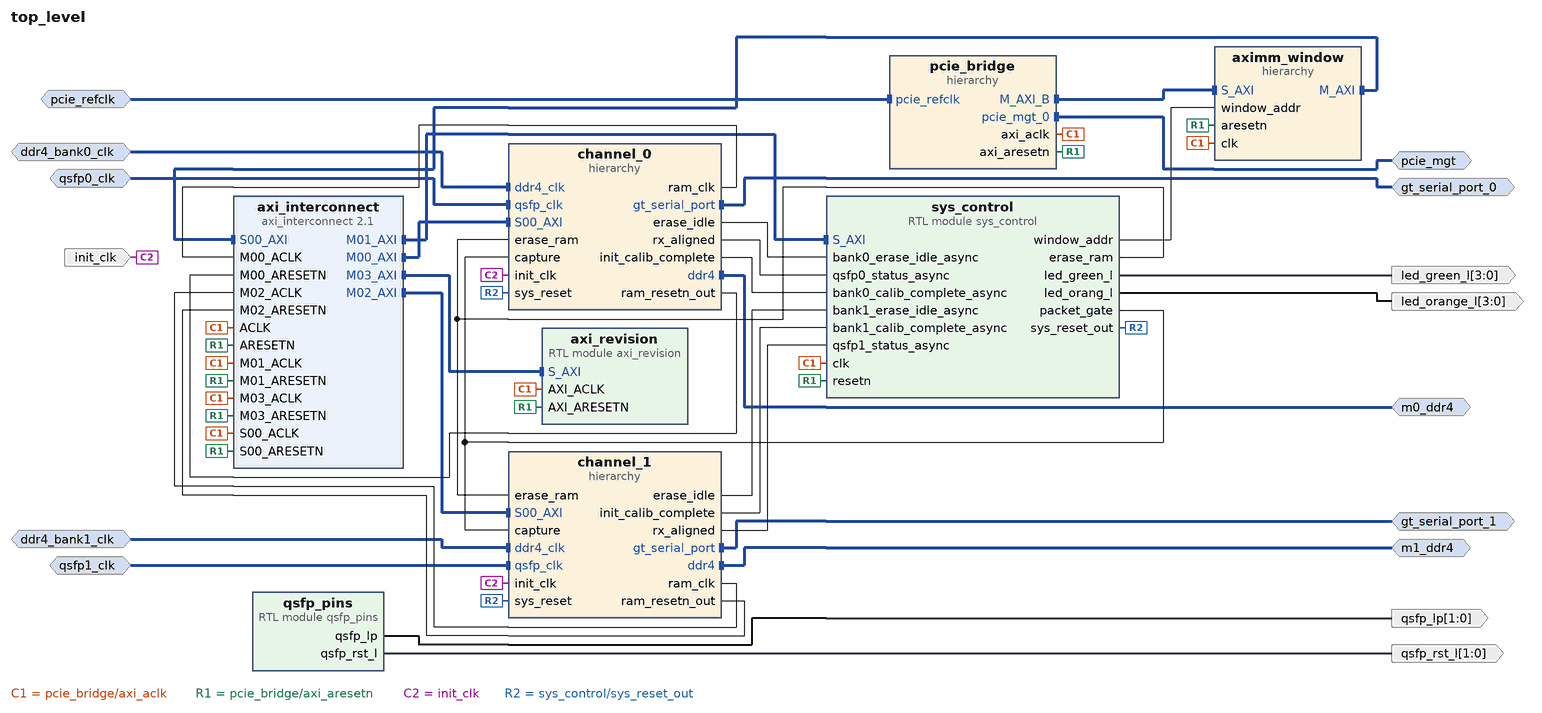
[diagram p0: block diagram of the top level]
# Vivado block design top_level, xcvu3p-ffvc1517-2-e, Vivado 2021.1
create_bd_design top_level

create_bd_intf_port -mode Slave -vlnv xilinx.com:interface:diff_clock_rtl:1.0 pcie_refclk
create_bd_intf_port -mode Master -vlnv xilinx.com:interface:pcie_7x_mgt_rtl:1.0 pcie_mgt
create_bd_intf_port -mode Slave -vlnv xilinx.com:interface:diff_clock_rtl:1.0 ddr4_bank0_clk
create_bd_intf_port -mode Master -vlnv xilinx.com:interface:ddr4_rtl:1.0 m0_ddr4
create_bd_intf_port -mode Slave -vlnv xilinx.com:interface:diff_clock_rtl:1.0 qsfp0_clk
set_property -dict {CONFIG.FREQ_HZ 322265625} [get_bd_intf_ports qsfp0_clk]
create_bd_intf_port -mode Master -vlnv xilinx.com:interface:gt_rtl:1.0 gt_serial_port_0
create_bd_intf_port -mode Master -vlnv xilinx.com:interface:ddr4_rtl:1.0 m1_ddr4
create_bd_intf_port -mode Master -vlnv xilinx.com:interface:gt_rtl:1.0 gt_serial_port_1
create_bd_intf_port -mode Slave -vlnv xilinx.com:interface:diff_clock_rtl:1.0 ddr4_bank1_clk
create_bd_intf_port -mode Slave -vlnv xilinx.com:interface:diff_clock_rtl:1.0 qsfp1_clk
set_property -dict {CONFIG.FREQ_HZ 322265625} [get_bd_intf_ports qsfp1_clk]
create_bd_port -dir I -type clk init_clk
create_bd_port -dir O -from 3 -to 0 led_orange_l
create_bd_port -dir O -from 3 -to 0 led_green_l
create_bd_port -dir O -from 1 -to 0 qsfp_rst_l
create_bd_port -dir O -from 1 -to 0 qsfp_lp

create_bd_cell -type hier pcie_bridge
create_bd_cell -type ip -vlnv xilinx.com:ip:axi_interconnect:2.1 axi_interconnect
set_property -dict [list \
  CONFIG.ENABLE_ADVANCED_OPTIONS 1 \
  CONFIG.NUM_MI 4 \
  CONFIG.NUM_SI 1 \
  CONFIG.XBAR_DATA_WIDTH 512 \
] [get_bd_cells axi_interconnect]
create_bd_cell -type hier channel_0
create_bd_cell -type hier aximm_window
create_bd_cell -type hier channel_1
create_bd_cell -type module -reference sys_control sys_control
create_bd_cell -type module -reference qsfp_pins qsfp_pins
create_bd_cell -type module -reference axi_revision axi_revision

# ---- hierarchy /pcie_bridge ----
current_bd_instance /pcie_bridge
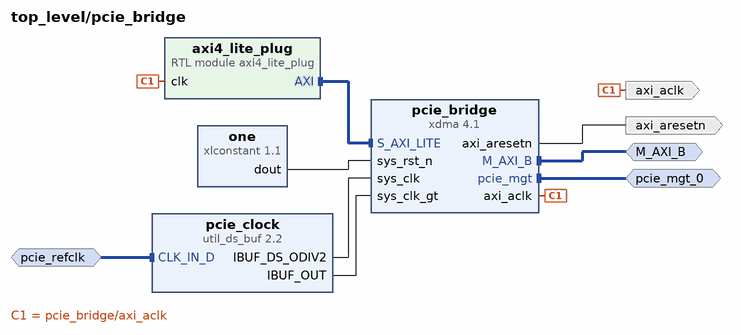
[diagram p1: block diagram inside /pcie_bridge]
create_bd_intf_pin -mode Master -vlnv xilinx.com:interface:pcie_7x_mgt_rtl:1.0 pcie_mgt_0
create_bd_intf_pin -mode Slave -vlnv xilinx.com:interface:diff_clock_rtl:1.0 pcie_refclk
create_bd_intf_pin -mode Master -vlnv xilinx.com:interface:aximm_rtl:1.0 M_AXI_B
create_bd_pin -dir O -type clk axi_aclk
create_bd_pin -dir O -type rst axi_aresetn

create_bd_cell -type ip -vlnv xilinx.com:ip:xdma:4.1 pcie_bridge
set_property -dict [list \
  CONFIG.PF0_DEVICE_ID_mqdma 903F \
  CONFIG.PF0_SRIOV_VF_DEVICE_ID A03F \
  CONFIG.PF2_DEVICE_ID_mqdma 923F \
  CONFIG.PF3_DEVICE_ID_mqdma 933F \
  CONFIG.axi_addr_width 64 \
  CONFIG.axi_data_width 512_bit \
  CONFIG.axisten_freq 250 \
  CONFIG.bridge_burst true \
  CONFIG.en_axi_slave_if false \
  CONFIG.functional_mode AXI_Bridge \
  CONFIG.mode_selection Advanced \
  CONFIG.pciebar2axibar_1 0x1000000000 \
  CONFIG.pf0_bar0_scale Megabytes \
  CONFIG.pf0_bar0_size 1 \
  CONFIG.pf0_bar1_enabled true \
  CONFIG.pf0_bar1_scale Megabytes \
  CONFIG.pf0_bar1_size 1 \
  CONFIG.pf0_device_id 903F \
  CONFIG.pl_link_cap_max_link_speed 8.0_GT/s \
  CONFIG.pl_link_cap_max_link_width X16 \
  CONFIG.plltype QPLL1 \
] [get_bd_cells pcie_bridge]
create_bd_cell -type ip -vlnv xilinx.com:ip:util_ds_buf:2.2 pcie_clock
set_property -dict {CONFIG.C_BUF_TYPE IBUFDSGTE} [get_bd_cells pcie_clock]
create_bd_cell -type ip -vlnv xilinx.com:ip:xlconstant:1.1 one
create_bd_cell -type module -reference axi4_lite_plug axi4_lite_plug

# ---- hierarchy /channel_0 ----
current_bd_instance /channel_0
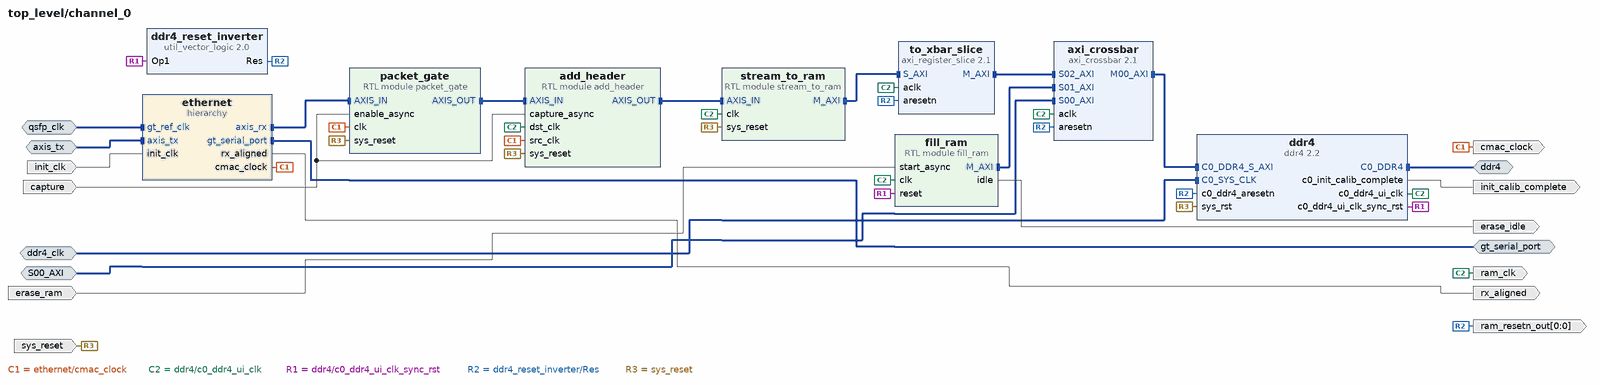
[diagram p2: block diagram inside /channel_0]
create_bd_intf_pin -mode Slave -vlnv xilinx.com:interface:aximm_rtl:1.0 S00_AXI
create_bd_intf_pin -mode Slave -vlnv xilinx.com:interface:diff_clock_rtl:1.0 ddr4_clk
create_bd_intf_pin -mode Master -vlnv xilinx.com:interface:ddr4_rtl:1.0 ddr4
create_bd_intf_pin -mode Slave -vlnv xilinx.com:interface:diff_clock_rtl:1.0 qsfp_clk
create_bd_intf_pin -mode Master -vlnv xilinx.com:interface:gt_rtl:1.0 gt_serial_port
create_bd_intf_pin -mode Slave -vlnv xilinx.com:interface:axis_rtl:1.0 axis_tx
create_bd_pin -dir O -type clk ram_clk
create_bd_pin -dir O init_calib_complete
create_bd_pin -dir I -type rst sys_reset
create_bd_pin -dir O -from 0 -to 0 ram_resetn_out
create_bd_pin -dir I erase_ram
create_bd_pin -dir O erase_idle
create_bd_pin -dir I capture
create_bd_pin -dir I -type clk init_clk
create_bd_pin -dir O cmac_clock
create_bd_pin -dir O rx_aligned

create_bd_cell -type ip -vlnv xilinx.com:ip:axi_crossbar:2.1 axi_crossbar
set_property -dict [list \
  CONFIG.NUM_MI 1 \
  CONFIG.NUM_SI 3 \
  CONFIG.S01_BASE_ID 0x00000010 \
  CONFIG.S02_BASE_ID 0x00000020 \
  CONFIG.S03_BASE_ID 0x00000030 \
  CONFIG.S04_BASE_ID 0x00000040 \
  CONFIG.S05_BASE_ID 0x00000050 \
  CONFIG.S06_BASE_ID 0x00000060 \
  CONFIG.S07_BASE_ID 0x00000070 \
  CONFIG.S08_BASE_ID 0x00000080 \
  CONFIG.S09_BASE_ID 0x00000090 \
  CONFIG.S10_BASE_ID 0x000000a0 \
  CONFIG.S11_BASE_ID 0x000000b0 \
  CONFIG.S12_BASE_ID 0x000000c0 \
  CONFIG.S13_BASE_ID 0x000000d0 \
  CONFIG.S14_BASE_ID 0x000000e0 \
  CONFIG.S15_BASE_ID 0x000000f0 \
] [get_bd_cells axi_crossbar]
create_bd_cell -type ip -vlnv xilinx.com:ip:ddr4:2.2 ddr4
set_property -dict [list \
  CONFIG.C0.DDR4_AxiAddressWidth 32 \
  CONFIG.C0.DDR4_AxiDataWidth 512 \
  CONFIG.C0.DDR4_DataMask DM_NO_DBI \
  CONFIG.C0.DDR4_DataWidth 64 \
  CONFIG.C0.DDR4_InputClockPeriod 10000 \
] [get_bd_cells ddr4]
create_bd_cell -type ip -vlnv xilinx.com:ip:util_vector_logic:2.0 ddr4_reset_inverter
set_property -dict {CONFIG.C_OPERATION not CONFIG.C_SIZE 1} [get_bd_cells ddr4_reset_inverter]
create_bd_cell -type hier ethernet
create_bd_cell -type ip -vlnv xilinx.com:ip:axi_register_slice:2.1 to_xbar_slice
create_bd_cell -type module -reference add_header add_header
create_bd_cell -type module -reference fill_ram fill_ram
create_bd_cell -type module -reference packet_gate packet_gate
create_bd_cell -type module -reference stream_to_ram stream_to_ram

# ---- hierarchy /channel_0/ethernet ----
current_bd_instance /channel_0/ethernet
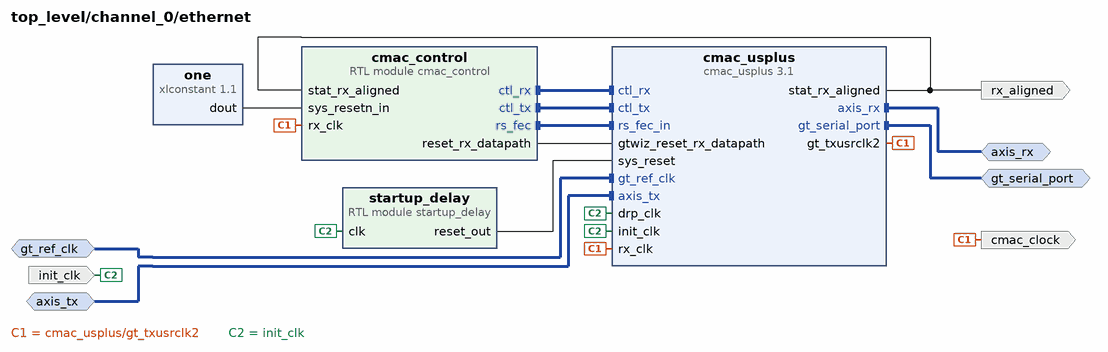
[diagram p3: block diagram inside /channel_0/ethernet]
create_bd_intf_pin -mode Slave -vlnv xilinx.com:interface:diff_clock_rtl:1.0 gt_ref_clk
create_bd_intf_pin -mode Master -vlnv xilinx.com:interface:gt_rtl:1.0 gt_serial_port
create_bd_intf_pin -mode Slave -vlnv xilinx.com:interface:axis_rtl:1.0 axis_tx
create_bd_intf_pin -mode Master -vlnv xilinx.com:interface:axis_rtl:1.0 axis_rx
create_bd_pin -dir I -type clk init_clk
create_bd_pin -dir O cmac_clock
create_bd_pin -dir O rx_aligned

create_bd_cell -type ip -vlnv xilinx.com:ip:cmac_usplus:3.1 cmac_usplus
set_property -dict [list \
  CONFIG.CMAC_CAUI4_MODE 1 \
  CONFIG.CMAC_CORE_SELECT CMACE4_X0Y2 \
  CONFIG.GT_GROUP_SELECT {X0Y16~X0Y19} \
  CONFIG.GT_REF_CLK_FREQ 322.265625 \
  CONFIG.INCLUDE_RS_FEC 1 \
  CONFIG.NUM_LANES 4x25 \
  CONFIG.RX_FLOW_CONTROL 0 \
  CONFIG.TX_FLOW_CONTROL 0 \
  CONFIG.USER_INTERFACE AXIS \
] [get_bd_cells cmac_usplus]
create_bd_cell -type module -reference cmac_control cmac_control
create_bd_cell -type ip -vlnv xilinx.com:ip:xlconstant:1.1 one
create_bd_cell -type module -reference startup_delay startup_delay

# ---- hierarchy /aximm_window ----
current_bd_instance /aximm_window
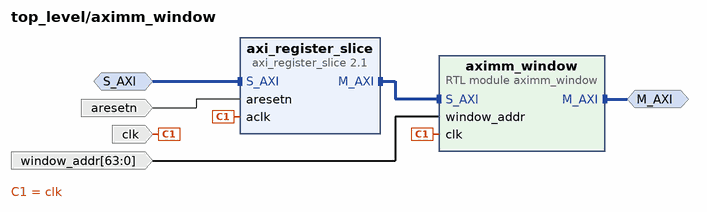
[diagram p4: block diagram inside /aximm_window]
create_bd_intf_pin -mode Master -vlnv xilinx.com:interface:aximm_rtl:1.0 M_AXI
create_bd_intf_pin -mode Slave -vlnv xilinx.com:interface:aximm_rtl:1.0 S_AXI
create_bd_pin -dir I -type clk clk
create_bd_pin -dir I -from 63 -to 0 window_addr
create_bd_pin -dir I -type rst aresetn

create_bd_cell -type ip -vlnv xilinx.com:ip:axi_register_slice:2.1 axi_register_slice
create_bd_cell -type module -reference aximm_window aximm_window

# ---- hierarchy /channel_1 ----
current_bd_instance /channel_1
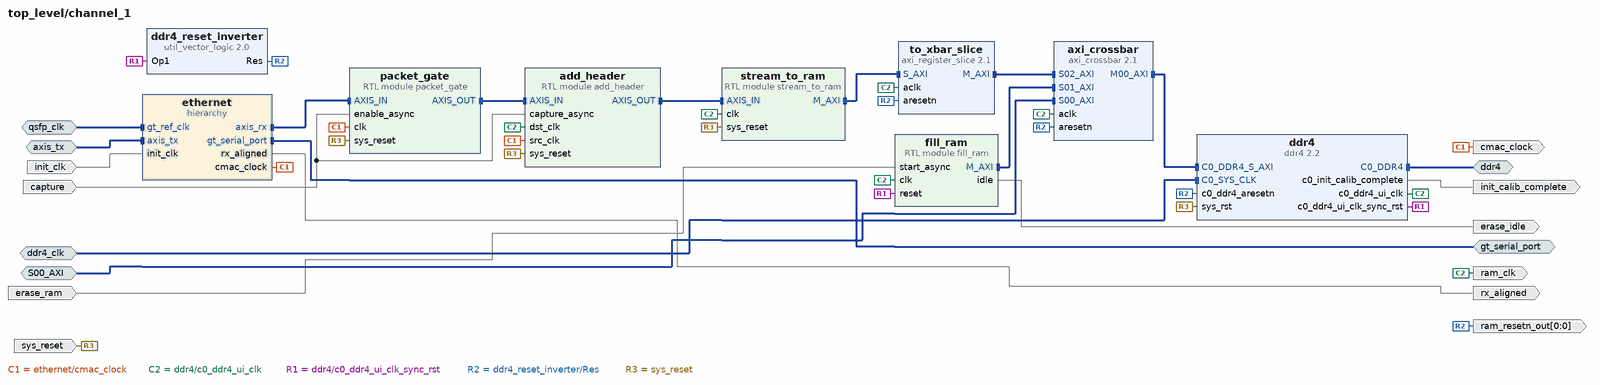
[diagram p5: block diagram inside /channel_1]
create_bd_intf_pin -mode Slave -vlnv xilinx.com:interface:aximm_rtl:1.0 S00_AXI
create_bd_intf_pin -mode Slave -vlnv xilinx.com:interface:diff_clock_rtl:1.0 ddr4_clk
create_bd_intf_pin -mode Master -vlnv xilinx.com:interface:ddr4_rtl:1.0 ddr4
create_bd_intf_pin -mode Slave -vlnv xilinx.com:interface:diff_clock_rtl:1.0 qsfp_clk
create_bd_intf_pin -mode Master -vlnv xilinx.com:interface:gt_rtl:1.0 gt_serial_port
create_bd_intf_pin -mode Slave -vlnv xilinx.com:interface:axis_rtl:1.0 axis_tx
create_bd_pin -dir O -type clk ram_clk
create_bd_pin -dir O init_calib_complete
create_bd_pin -dir I -type rst sys_reset
create_bd_pin -dir O -from 0 -to 0 ram_resetn_out
create_bd_pin -dir I erase_ram
create_bd_pin -dir O erase_idle
create_bd_pin -dir I capture
create_bd_pin -dir I -type clk init_clk
create_bd_pin -dir O cmac_clock
create_bd_pin -dir O rx_aligned

create_bd_cell -type ip -vlnv xilinx.com:ip:axi_crossbar:2.1 axi_crossbar
set_property -dict [list \
  CONFIG.NUM_MI 1 \
  CONFIG.NUM_SI 3 \
  CONFIG.S01_BASE_ID 0x00000010 \
  CONFIG.S02_BASE_ID 0x00000020 \
  CONFIG.S03_BASE_ID 0x00000030 \
  CONFIG.S04_BASE_ID 0x00000040 \
  CONFIG.S05_BASE_ID 0x00000050 \
  CONFIG.S06_BASE_ID 0x00000060 \
  CONFIG.S07_BASE_ID 0x00000070 \
  CONFIG.S08_BASE_ID 0x00000080 \
  CONFIG.S09_BASE_ID 0x00000090 \
  CONFIG.S10_BASE_ID 0x000000a0 \
  CONFIG.S11_BASE_ID 0x000000b0 \
  CONFIG.S12_BASE_ID 0x000000c0 \
  CONFIG.S13_BASE_ID 0x000000d0 \
  CONFIG.S14_BASE_ID 0x000000e0 \
  CONFIG.S15_BASE_ID 0x000000f0 \
] [get_bd_cells axi_crossbar]
create_bd_cell -type ip -vlnv xilinx.com:ip:ddr4:2.2 ddr4
set_property -dict [list \
  CONFIG.C0.DDR4_AxiAddressWidth 32 \
  CONFIG.C0.DDR4_AxiDataWidth 512 \
  CONFIG.C0.DDR4_DataMask DM_NO_DBI \
  CONFIG.C0.DDR4_DataWidth 64 \
  CONFIG.C0.DDR4_InputClockPeriod 10000 \
] [get_bd_cells ddr4]
create_bd_cell -type ip -vlnv xilinx.com:ip:util_vector_logic:2.0 ddr4_reset_inverter
set_property -dict {CONFIG.C_OPERATION not CONFIG.C_SIZE 1} [get_bd_cells ddr4_reset_inverter]
create_bd_cell -type hier ethernet
create_bd_cell -type ip -vlnv xilinx.com:ip:axi_register_slice:2.1 to_xbar_slice
create_bd_cell -type module -reference add_header add_header
set_property -dict {CONFIG.CHANNEL 1} [get_bd_cells add_header]
create_bd_cell -type module -reference fill_ram fill_ram
set_property -dict {CONFIG.CHANNEL 1} [get_bd_cells fill_ram]
create_bd_cell -type module -reference packet_gate packet_gate
create_bd_cell -type module -reference stream_to_ram stream_to_ram
set_property -dict {CONFIG.CHANNEL 1} [get_bd_cells stream_to_ram]

# ---- hierarchy /channel_1/ethernet ----
current_bd_instance /channel_1/ethernet
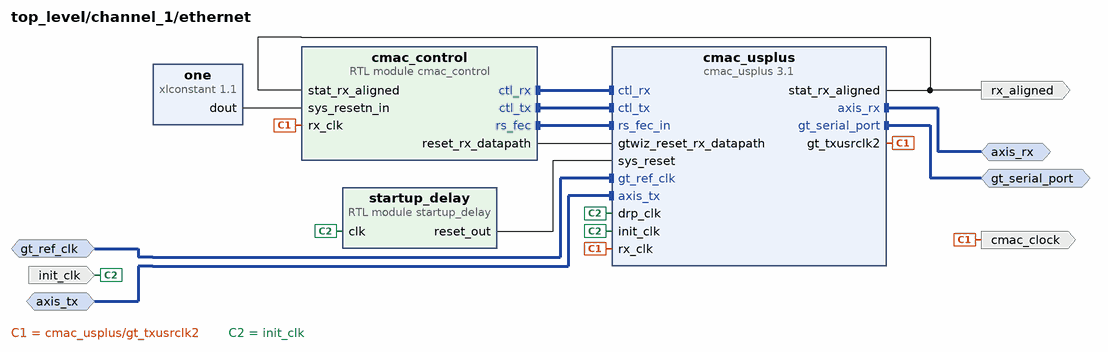
[diagram p6: block diagram inside /channel_1/ethernet]
create_bd_intf_pin -mode Slave -vlnv xilinx.com:interface:diff_clock_rtl:1.0 gt_ref_clk
create_bd_intf_pin -mode Master -vlnv xilinx.com:interface:gt_rtl:1.0 gt_serial_port
create_bd_intf_pin -mode Slave -vlnv xilinx.com:interface:axis_rtl:1.0 axis_tx
create_bd_intf_pin -mode Master -vlnv xilinx.com:interface:axis_rtl:1.0 axis_rx
create_bd_pin -dir I -type clk init_clk
create_bd_pin -dir O cmac_clock
create_bd_pin -dir O rx_aligned

create_bd_cell -type ip -vlnv xilinx.com:ip:cmac_usplus:3.1 cmac_usplus
set_property -dict [list \
  CONFIG.CMAC_CAUI4_MODE 1 \
  CONFIG.CMAC_CORE_SELECT CMACE4_X0Y0 \
  CONFIG.GT_GROUP_SELECT {X0Y4~X0Y7} \
  CONFIG.GT_REF_CLK_FREQ 322.265625 \
  CONFIG.INCLUDE_RS_FEC 1 \
  CONFIG.NUM_LANES 4x25 \
  CONFIG.RX_FLOW_CONTROL 0 \
  CONFIG.TX_FLOW_CONTROL 0 \
  CONFIG.USER_INTERFACE AXIS \
] [get_bd_cells cmac_usplus]
create_bd_cell -type module -reference cmac_control cmac_control
create_bd_cell -type ip -vlnv xilinx.com:ip:xlconstant:1.1 one
create_bd_cell -type module -reference startup_delay startup_delay

# ---- connections ----

current_bd_instance /pcie_bridge
connect_bd_intf_net [get_bd_intf_pins pcie_refclk] [get_bd_intf_pins pcie_clock/CLK_IN_D]
connect_bd_intf_net [get_bd_intf_pins M_AXI_B] [get_bd_intf_pins pcie_bridge/M_AXI_B]
connect_bd_intf_net [get_bd_intf_pins axi4_lite_plug/AXI] [get_bd_intf_pins pcie_bridge/S_AXI_LITE]
connect_bd_intf_net [get_bd_intf_pins pcie_mgt_0] [get_bd_intf_pins pcie_bridge/pcie_mgt]
connect_bd_net [get_bd_pins pcie_bridge/axi_aclk] [get_bd_pins axi_aclk] [get_bd_pins axi4_lite_plug/clk]
connect_bd_net [get_bd_pins pcie_bridge/axi_aresetn] [get_bd_pins axi_aresetn]
connect_bd_net -net util_ds_buf_0_IBUF_DS_ODIV2 [get_bd_pins pcie_clock/IBUF_DS_ODIV2] [get_bd_pins pcie_bridge/sys_clk]
connect_bd_net -net util_ds_buf_0_IBUF_OUT [get_bd_pins pcie_clock/IBUF_OUT] [get_bd_pins pcie_bridge/sys_clk_gt]
connect_bd_net -net xlconstant_0_dout [get_bd_pins one/dout] [get_bd_pins pcie_bridge/sys_rst_n]

current_bd_instance /channel_0
connect_bd_intf_net [get_bd_intf_pins ddr4_clk] [get_bd_intf_pins ddr4/C0_SYS_CLK]
connect_bd_intf_net [get_bd_intf_pins qsfp_clk] [get_bd_intf_pins ethernet/gt_ref_clk]
connect_bd_intf_net [get_bd_intf_pins gt_serial_port] [get_bd_intf_pins ethernet/gt_serial_port]
connect_bd_intf_net [get_bd_intf_pins axis_tx] [get_bd_intf_pins ethernet/axis_tx]
connect_bd_intf_net [get_bd_intf_pins stream_to_ram/AXIS_IN] [get_bd_intf_pins add_header/AXIS_OUT]
connect_bd_intf_net [get_bd_intf_pins ddr4/C0_DDR4_S_AXI] [get_bd_intf_pins axi_crossbar/M00_AXI]
connect_bd_intf_net [get_bd_intf_pins S00_AXI] [get_bd_intf_pins axi_crossbar/S00_AXI]
connect_bd_intf_net [get_bd_intf_pins axi_crossbar/S02_AXI] [get_bd_intf_pins to_xbar_slice/M_AXI]
connect_bd_intf_net [get_bd_intf_pins ddr4] [get_bd_intf_pins ddr4/C0_DDR4]
connect_bd_intf_net [get_bd_intf_pins packet_gate/AXIS_IN] [get_bd_intf_pins ethernet/axis_rx]
connect_bd_intf_net [get_bd_intf_pins fill_ram/M_AXI] [get_bd_intf_pins axi_crossbar/S01_AXI]
connect_bd_intf_net [get_bd_intf_pins packet_gate/AXIS_OUT] [get_bd_intf_pins add_header/AXIS_IN]
connect_bd_intf_net [get_bd_intf_pins stream_to_ram/M_AXI] [get_bd_intf_pins to_xbar_slice/S_AXI]
connect_bd_net -net clk_1 [get_bd_pins ethernet/cmac_clock] [get_bd_pins cmac_clock] [get_bd_pins add_header/src_clk] [get_bd_pins packet_gate/clk]
connect_bd_net -net ddr4_0_c0_ddr4_ui_clk [get_bd_pins ddr4/c0_ddr4_ui_clk] \
  [get_bd_pins ram_clk] [get_bd_pins axi_crossbar/aclk] [get_bd_pins to_xbar_slice/aclk] [get_bd_pins add_header/dst_clk] \
  [get_bd_pins fill_ram/clk] [get_bd_pins stream_to_ram/clk]
connect_bd_net -net ddr4_0_c0_init_calib_complete [get_bd_pins ddr4/c0_init_calib_complete] [get_bd_pins init_calib_complete]
connect_bd_net [get_bd_pins ddr4/c0_ddr4_ui_clk_sync_rst] [get_bd_pins ddr4_reset_inverter/Op1] [get_bd_pins fill_ram/reset]
connect_bd_net -net enable_async_1 [get_bd_pins capture] [get_bd_pins add_header/capture_async] [get_bd_pins packet_gate/enable_async]
connect_bd_net -net ethernet_stat_rx_aligned [get_bd_pins ethernet/rx_aligned] [get_bd_pins rx_aligned]
connect_bd_net [get_bd_pins fill_ram/idle] [get_bd_pins erase_idle]
connect_bd_net [get_bd_pins init_clk] [get_bd_pins ethernet/init_clk]
connect_bd_net -net reset_inverter_Res [get_bd_pins ddr4_reset_inverter/Res] \
  [get_bd_pins ram_resetn_out] [get_bd_pins axi_crossbar/aresetn] [get_bd_pins ddr4/c0_ddr4_aresetn] \
  [get_bd_pins to_xbar_slice/aresetn]
connect_bd_net -net sys_sync_start_1 [get_bd_pins erase_ram] [get_bd_pins fill_ram/start_async]
connect_bd_net -net zero_dout [get_bd_pins sys_reset] \
  [get_bd_pins ddr4/sys_rst] [get_bd_pins add_header/sys_reset] [get_bd_pins packet_gate/sys_reset] \
  [get_bd_pins stream_to_ram/sys_reset]

current_bd_instance /channel_0/ethernet
connect_bd_intf_net [get_bd_intf_pins gt_ref_clk] [get_bd_intf_pins cmac_usplus/gt_ref_clk]
connect_bd_intf_net [get_bd_intf_pins gt_serial_port] [get_bd_intf_pins cmac_usplus/gt_serial_port]
connect_bd_intf_net [get_bd_intf_pins axis_tx] [get_bd_intf_pins cmac_usplus/axis_tx]
connect_bd_intf_net [get_bd_intf_pins cmac_control/ctl_rx] [get_bd_intf_pins cmac_usplus/ctl_rx]
connect_bd_intf_net [get_bd_intf_pins cmac_control/ctl_tx] [get_bd_intf_pins cmac_usplus/ctl_tx]
connect_bd_intf_net [get_bd_intf_pins cmac_control/rs_fec] [get_bd_intf_pins cmac_usplus/rs_fec_in]
connect_bd_intf_net [get_bd_intf_pins axis_rx] [get_bd_intf_pins cmac_usplus/axis_rx]
connect_bd_net [get_bd_pins cmac_control/reset_rx_datapath] [get_bd_pins cmac_usplus/gtwiz_reset_rx_datapath]
connect_bd_net -net cmac_usplus_0_gt_txusrclk2 [get_bd_pins cmac_usplus/gt_txusrclk2] \
  [get_bd_pins cmac_usplus/rx_clk] [get_bd_pins cmac_clock] [get_bd_pins cmac_control/rx_clk]
connect_bd_net -net cmac_usplus_0_stat_rx_aligned [get_bd_pins cmac_usplus/stat_rx_aligned] \
  [get_bd_pins rx_aligned] [get_bd_pins cmac_control/stat_rx_aligned]
connect_bd_net -net init_clk_0_1 [get_bd_pins init_clk] \
  [get_bd_pins cmac_usplus/init_clk] [get_bd_pins cmac_usplus/drp_clk] [get_bd_pins startup_delay/clk]
connect_bd_net [get_bd_pins one/dout] [get_bd_pins cmac_control/sys_resetn_in]
connect_bd_net -net startup_delay_0_reset_out [get_bd_pins startup_delay/reset_out] [get_bd_pins cmac_usplus/sys_reset]

current_bd_instance /aximm_window
connect_bd_intf_net [get_bd_intf_pins S_AXI] [get_bd_intf_pins axi_register_slice/S_AXI]
connect_bd_intf_net [get_bd_intf_pins axi_register_slice/M_AXI] [get_bd_intf_pins aximm_window/S_AXI]
connect_bd_intf_net [get_bd_intf_pins M_AXI] [get_bd_intf_pins aximm_window/M_AXI]
connect_bd_net -net S00_ACLK_1 [get_bd_pins clk] [get_bd_pins axi_register_slice/aclk] [get_bd_pins aximm_window/clk]
connect_bd_net [get_bd_pins aresetn] [get_bd_pins axi_register_slice/aresetn]
connect_bd_net -net sys_control_window_addr [get_bd_pins window_addr] [get_bd_pins aximm_window/window_addr]

current_bd_instance /channel_1
connect_bd_intf_net [get_bd_intf_pins ddr4_clk] [get_bd_intf_pins ddr4/C0_SYS_CLK]
connect_bd_intf_net [get_bd_intf_pins qsfp_clk] [get_bd_intf_pins ethernet/gt_ref_clk]
connect_bd_intf_net [get_bd_intf_pins gt_serial_port] [get_bd_intf_pins ethernet/gt_serial_port]
connect_bd_intf_net [get_bd_intf_pins axis_tx] [get_bd_intf_pins ethernet/axis_tx]
connect_bd_intf_net [get_bd_intf_pins stream_to_ram/AXIS_IN] [get_bd_intf_pins add_header/AXIS_OUT]
connect_bd_intf_net [get_bd_intf_pins ddr4/C0_DDR4_S_AXI] [get_bd_intf_pins axi_crossbar/M00_AXI]
connect_bd_intf_net [get_bd_intf_pins S00_AXI] [get_bd_intf_pins axi_crossbar/S00_AXI]
connect_bd_intf_net [get_bd_intf_pins axi_crossbar/S02_AXI] [get_bd_intf_pins to_xbar_slice/M_AXI]
connect_bd_intf_net [get_bd_intf_pins ddr4] [get_bd_intf_pins ddr4/C0_DDR4]
connect_bd_intf_net [get_bd_intf_pins packet_gate/AXIS_IN] [get_bd_intf_pins ethernet/axis_rx]
connect_bd_intf_net [get_bd_intf_pins fill_ram/M_AXI] [get_bd_intf_pins axi_crossbar/S01_AXI]
connect_bd_intf_net [get_bd_intf_pins packet_gate/AXIS_OUT] [get_bd_intf_pins add_header/AXIS_IN]
connect_bd_intf_net [get_bd_intf_pins stream_to_ram/M_AXI] [get_bd_intf_pins to_xbar_slice/S_AXI]
connect_bd_net -net clk_1 [get_bd_pins ethernet/cmac_clock] [get_bd_pins cmac_clock] [get_bd_pins add_header/src_clk] [get_bd_pins packet_gate/clk]
connect_bd_net -net ddr4_0_c0_ddr4_ui_clk [get_bd_pins ddr4/c0_ddr4_ui_clk] \
  [get_bd_pins ram_clk] [get_bd_pins axi_crossbar/aclk] [get_bd_pins to_xbar_slice/aclk] [get_bd_pins add_header/dst_clk] \
  [get_bd_pins fill_ram/clk] [get_bd_pins stream_to_ram/clk]
connect_bd_net -net ddr4_0_c0_init_calib_complete [get_bd_pins ddr4/c0_init_calib_complete] [get_bd_pins init_calib_complete]
connect_bd_net [get_bd_pins ddr4/c0_ddr4_ui_clk_sync_rst] [get_bd_pins ddr4_reset_inverter/Op1] [get_bd_pins fill_ram/reset]
connect_bd_net -net enable_async_1 [get_bd_pins capture] [get_bd_pins add_header/capture_async] [get_bd_pins packet_gate/enable_async]
connect_bd_net -net ethernet_stat_rx_aligned [get_bd_pins ethernet/rx_aligned] [get_bd_pins rx_aligned]
connect_bd_net [get_bd_pins fill_ram/idle] [get_bd_pins erase_idle]
connect_bd_net [get_bd_pins init_clk] [get_bd_pins ethernet/init_clk]
connect_bd_net -net reset_inverter_Res [get_bd_pins ddr4_reset_inverter/Res] \
  [get_bd_pins ram_resetn_out] [get_bd_pins axi_crossbar/aresetn] [get_bd_pins ddr4/c0_ddr4_aresetn] \
  [get_bd_pins to_xbar_slice/aresetn]
connect_bd_net -net sys_sync_start_1 [get_bd_pins erase_ram] [get_bd_pins fill_ram/start_async]
connect_bd_net -net zero_dout [get_bd_pins sys_reset] \
  [get_bd_pins ddr4/sys_rst] [get_bd_pins add_header/sys_reset] [get_bd_pins packet_gate/sys_reset] \
  [get_bd_pins stream_to_ram/sys_reset]

current_bd_instance /channel_1/ethernet
connect_bd_intf_net [get_bd_intf_pins gt_ref_clk] [get_bd_intf_pins cmac_usplus/gt_ref_clk]
connect_bd_intf_net [get_bd_intf_pins gt_serial_port] [get_bd_intf_pins cmac_usplus/gt_serial_port]
connect_bd_intf_net [get_bd_intf_pins axis_tx] [get_bd_intf_pins cmac_usplus/axis_tx]
connect_bd_intf_net [get_bd_intf_pins cmac_control/ctl_rx] [get_bd_intf_pins cmac_usplus/ctl_rx]
connect_bd_intf_net [get_bd_intf_pins cmac_control/ctl_tx] [get_bd_intf_pins cmac_usplus/ctl_tx]
connect_bd_intf_net [get_bd_intf_pins cmac_control/rs_fec] [get_bd_intf_pins cmac_usplus/rs_fec_in]
connect_bd_intf_net [get_bd_intf_pins axis_rx] [get_bd_intf_pins cmac_usplus/axis_rx]
connect_bd_net [get_bd_pins cmac_control/reset_rx_datapath] [get_bd_pins cmac_usplus/gtwiz_reset_rx_datapath]
connect_bd_net -net cmac_usplus_0_gt_txusrclk2 [get_bd_pins cmac_usplus/gt_txusrclk2] \
  [get_bd_pins cmac_usplus/rx_clk] [get_bd_pins cmac_clock] [get_bd_pins cmac_control/rx_clk]
connect_bd_net -net cmac_usplus_0_stat_rx_aligned [get_bd_pins cmac_usplus/stat_rx_aligned] \
  [get_bd_pins rx_aligned] [get_bd_pins cmac_control/stat_rx_aligned]
connect_bd_net -net init_clk_0_1 [get_bd_pins init_clk] \
  [get_bd_pins cmac_usplus/init_clk] [get_bd_pins cmac_usplus/drp_clk] [get_bd_pins startup_delay/clk]
connect_bd_net [get_bd_pins one/dout] [get_bd_pins cmac_control/sys_resetn_in]
connect_bd_net [get_bd_pins startup_delay/reset_out] [get_bd_pins cmac_usplus/sys_reset]

current_bd_instance /
connect_bd_intf_net [get_bd_intf_pins pcie_bridge/M_AXI_B] [get_bd_intf_pins aximm_window/S_AXI]
connect_bd_intf_net [get_bd_intf_pins aximm_window/M_AXI] [get_bd_intf_pins axi_interconnect/S00_AXI]
connect_bd_intf_net [get_bd_intf_ports ddr4_bank0_clk] [get_bd_intf_pins channel_0/ddr4_clk]
connect_bd_intf_net [get_bd_intf_ports pcie_refclk] [get_bd_intf_pins pcie_bridge/pcie_refclk]
connect_bd_intf_net [get_bd_intf_pins channel_1/S00_AXI] [get_bd_intf_pins axi_interconnect/M02_AXI]
connect_bd_intf_net [get_bd_intf_pins sys_control/S_AXI] [get_bd_intf_pins axi_interconnect/M01_AXI]
connect_bd_intf_net [get_bd_intf_pins axi_interconnect/M00_AXI] [get_bd_intf_pins channel_0/S00_AXI]
connect_bd_intf_net [get_bd_intf_pins axi_interconnect/M03_AXI] [get_bd_intf_pins axi_revision/S_AXI]
connect_bd_intf_net [get_bd_intf_ports gt_serial_port_0] [get_bd_intf_pins channel_0/gt_serial_port]
connect_bd_intf_net [get_bd_intf_ports m1_ddr4] [get_bd_intf_pins channel_1/ddr4]
connect_bd_intf_net [get_bd_intf_ports gt_serial_port_1] [get_bd_intf_pins channel_1/gt_serial_port]
connect_bd_intf_net [get_bd_intf_ports m0_ddr4] [get_bd_intf_pins channel_0/ddr4]
connect_bd_intf_net [get_bd_intf_ports ddr4_bank1_clk] [get_bd_intf_pins channel_1/ddr4_clk]
connect_bd_intf_net [get_bd_intf_ports pcie_mgt] [get_bd_intf_pins pcie_bridge/pcie_mgt_0]
connect_bd_intf_net [get_bd_intf_ports qsfp0_clk] [get_bd_intf_pins channel_0/qsfp_clk]
connect_bd_intf_net [get_bd_intf_ports qsfp1_clk] [get_bd_intf_pins channel_1/qsfp_clk]
connect_bd_net -net S00_ACLK_1 [get_bd_pins pcie_bridge/axi_aclk] \
  [get_bd_pins axi_interconnect/S00_ACLK] [get_bd_pins axi_interconnect/ACLK] [get_bd_pins axi_interconnect/M01_ACLK] \
  [get_bd_pins aximm_window/clk] [get_bd_pins axi_interconnect/M03_ACLK] [get_bd_pins sys_control/clk] \
  [get_bd_pins axi_revision/AXI_ACLK]
connect_bd_net -net S00_ARESETN_1 [get_bd_pins pcie_bridge/axi_aresetn] \
  [get_bd_pins axi_interconnect/S00_ARESETN] [get_bd_pins axi_interconnect/ARESETN] \
  [get_bd_pins axi_interconnect/M01_ARESETN] [get_bd_pins aximm_window/aresetn] [get_bd_pins axi_interconnect/M03_ARESETN] \
  [get_bd_pins sys_control/resetn] [get_bd_pins axi_revision/AXI_ARESETN]
connect_bd_net -net channel_0_idle [get_bd_pins channel_0/erase_idle] [get_bd_pins sys_control/bank0_erase_idle_async]
connect_bd_net [get_bd_pins channel_0/rx_aligned] [get_bd_pins sys_control/qsfp0_status_async]
connect_bd_net [get_bd_pins channel_1/erase_idle] [get_bd_pins sys_control/bank1_erase_idle_async]
connect_bd_net [get_bd_pins channel_1/init_calib_complete] [get_bd_pins sys_control/bank1_calib_complete_async]
connect_bd_net [get_bd_pins channel_1/ram_clk] [get_bd_pins axi_interconnect/M02_ACLK]
connect_bd_net [get_bd_pins channel_1/ram_resetn_out] [get_bd_pins axi_interconnect/M02_ARESETN]
connect_bd_net [get_bd_pins channel_1/rx_aligned] [get_bd_pins sys_control/qsfp1_status_async]
connect_bd_net -net ddr4_0_c0_ddr4_ui_clk [get_bd_pins channel_0/ram_clk] [get_bd_pins axi_interconnect/M00_ACLK]
connect_bd_net -net ddr4_0_c0_ddr4_ui_clk_sync_rst [get_bd_pins channel_0/ram_resetn_out] [get_bd_pins axi_interconnect/M00_ARESETN]
connect_bd_net -net ddr4_0_c0_init_calib_complete [get_bd_pins channel_0/init_calib_complete] [get_bd_pins sys_control/bank0_calib_complete_async]
connect_bd_net [get_bd_ports init_clk] [get_bd_pins channel_0/init_clk] [get_bd_pins channel_1/init_clk]
connect_bd_net [get_bd_pins qsfp_pins/qsfp_lp] [get_bd_ports qsfp_lp]
connect_bd_net [get_bd_pins qsfp_pins/qsfp_rst_l] [get_bd_ports qsfp_rst_l]
connect_bd_net -net sys_control_0_erase_ram [get_bd_pins sys_control/erase_ram] [get_bd_pins channel_0/erase_ram] [get_bd_pins channel_1/erase_ram]
connect_bd_net -net sys_control_0_sys_reset_out [get_bd_pins sys_control/sys_reset_out] \
  [get_bd_pins channel_0/sys_reset] [get_bd_pins channel_1/sys_reset]
connect_bd_net [get_bd_pins sys_control/led_green_l] [get_bd_ports led_green_l]
connect_bd_net [get_bd_pins sys_control/led_orang_l] [get_bd_ports led_orange_l]
connect_bd_net [get_bd_pins sys_control/packet_gate] [get_bd_pins channel_0/capture] [get_bd_pins channel_1/capture]
connect_bd_net [get_bd_pins sys_control/window_addr] [get_bd_pins aximm_window/window_addr]

# ---- address map ----
assign_bd_address -offset 0x0000000000000000 -range 4K -target_address_space [get_bd_addr_spaces aximm_window/aximm_window/M_AXI] [get_bd_addr_segs axi_revision/S_AXI/reg0]
assign_bd_address -offset 0x0000000000001000 -range 4K -target_address_space [get_bd_addr_spaces aximm_window/aximm_window/M_AXI] [get_bd_addr_segs sys_control/S_AXI/reg0]
assign_bd_address -offset 0x0000001000000000 -range 64G -target_address_space [get_bd_addr_spaces aximm_window/aximm_window/M_AXI] [get_bd_addr_segs channel_0/ddr4/C0_DDR4_MEMORY_MAP/C0_DDR4_ADDRESS_BLOCK]
assign_bd_address -offset 0x0000002000000000 -range 64G -target_address_space [get_bd_addr_spaces aximm_window/aximm_window/M_AXI] [get_bd_addr_segs channel_1/ddr4/C0_DDR4_MEMORY_MAP/C0_DDR4_ADDRESS_BLOCK]
assign_bd_address -offset 0x0000001000000000 -range 64G -target_address_space [get_bd_addr_spaces channel_0/fill_ram/M_AXI] [get_bd_addr_segs channel_0/ddr4/C0_DDR4_MEMORY_MAP/C0_DDR4_ADDRESS_BLOCK]
assign_bd_address -offset 0x0000001000000000 -range 64G -target_address_space [get_bd_addr_spaces channel_0/stream_to_ram/M_AXI] [get_bd_addr_segs channel_0/ddr4/C0_DDR4_MEMORY_MAP/C0_DDR4_ADDRESS_BLOCK]
assign_bd_address -offset 0x0000002000000000 -range 64G -target_address_space [get_bd_addr_spaces channel_1/fill_ram/M_AXI] [get_bd_addr_segs channel_1/ddr4/C0_DDR4_MEMORY_MAP/C0_DDR4_ADDRESS_BLOCK]
assign_bd_address -offset 0x0000002000000000 -range 64G -target_address_space [get_bd_addr_spaces channel_1/stream_to_ram/M_AXI] [get_bd_addr_segs channel_1/ddr4/C0_DDR4_MEMORY_MAP/C0_DDR4_ADDRESS_BLOCK]
assign_bd_address -offset 0x00000000 -range 512M -target_address_space [get_bd_addr_spaces pcie_bridge/axi4_lite_plug/AXI] [get_bd_addr_segs pcie_bridge/pcie_bridge/S_AXI_LITE/CTL0]
assign_bd_address -offset 0x0000000000000000 -range 16E -target_address_space [get_bd_addr_spaces pcie_bridge/pcie_bridge/M_AXI_B] [get_bd_addr_segs aximm_window/aximm_window/S_AXI/reg0]

validate_bd_design
save_bd_design
